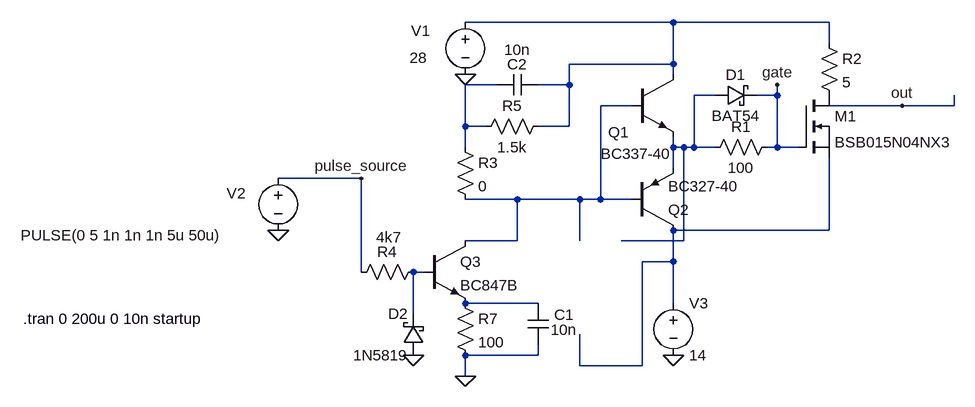
[diagram p0: schematic totem-pole driver.asc]
totem-pole driver.asc, the LTspice schematic file:
Version 4
SHEET 1 1708 680
WIRE -192 32 -512 32
WIRE 48 32 -192 32
WIRE 48 64 48 32
WIRE -192 96 -192 32
WIRE -192 96 -352 96
WIRE -192 112 -192 96
WIRE -464 128 -512 128
WIRE -352 128 -352 96
WIRE -352 128 -400 128
WIRE -128 144 -160 144
WIRE -32 144 -32 128
WIRE -32 144 -64 144
WIRE -256 160 -304 160
WIRE 160 160 48 160
WIRE 240 160 240 144
WIRE 240 160 160 160
WIRE -512 192 -512 128
WIRE -480 192 -512 192
WIRE -352 192 -352 128
WIRE -352 192 -400 192
WIRE -512 224 -512 192
WIRE -192 224 -192 208
WIRE -176 224 -192 224
WIRE -160 224 -160 144
WIRE -160 224 -176 224
WIRE -128 224 -160 224
WIRE -32 224 -32 144
WIRE -32 224 -48 224
WIRE 0 224 -32 224
WIRE -192 256 -192 224
WIRE -672 272 -800 272
WIRE -432 304 -512 304
WIRE -336 304 -432 304
WIRE -304 304 -304 160
WIRE -304 304 -336 304
WIRE -256 304 -304 304
WIRE 48 352 48 240
WIRE 48 352 -192 352
WIRE -432 368 -432 304
WIRE -432 368 -512 368
WIRE -336 368 -336 304
WIRE -176 368 -176 224
WIRE -176 368 -272 368
WIRE -192 400 -192 352
WIRE -192 400 -240 400
WIRE -672 416 -672 272
WIRE -576 416 -592 416
WIRE -400 464 -512 464
WIRE -192 464 -192 400
WIRE -592 480 -592 416
WIRE -400 544 -400 528
WIRE -400 544 -512 544
WIRE -336 560 -336 512
WIRE -240 560 -240 400
WIRE -240 560 -336 560
WIRE -512 576 -512 544
FLAG -512 112 0
FLAG -800 352 0
FLAG -512 576 0
FLAG -672 272 pulse_source
FLAG 160 160 out
FLAG -32 128 gate
FLAG -192 544 0
FLAG -592 544 0
SYMBOL npn -256 112 R0
WINDOW 0 -36 89 Left 2
WINDOW 3 -48 122 Left 2
SYMATTR InstName Q1
SYMATTR Value BC337-40
SYMBOL pnp -256 352 M180
SYMATTR InstName Q2
SYMATTR Value BC327-40
SYMBOL voltage -512 16 R0
WINDOW 0 -83 29 Left 2
WINDOW 3 -86 70 Left 2
WINDOW 123 0 0 Left 0
WINDOW 39 0 0 Left 0
SYMATTR InstName V1
SYMATTR Value 28
SYMBOL voltage -800 256 R0
WINDOW 0 -79 39 Left 2
WINDOW 3 -396 103 Left 2
WINDOW 123 0 0 Left 0
WINDOW 39 0 0 Left 0
SYMATTR InstName V2
SYMATTR Value PULSE(0 5 1n 1n 1n 5u 50u)
SYMBOL npn -576 368 R0
SYMATTR InstName Q3
SYMATTR Value BC847B
SYMBOL res -528 208 R0
SYMATTR InstName R3
SYMATTR Value 0
SYMBOL res -576 400 R90
WINDOW 0 0 56 VBottom 2
WINDOW 3 -53 54 VTop 2
SYMATTR InstName R4
SYMATTR Value 4k7
SYMBOL res -32 208 R90
WINDOW 0 0 56 VBottom 2
WINDOW 3 32 56 VTop 2
SYMATTR InstName R1
SYMATTR Value 100
SYMBOL res 32 48 R0
SYMATTR InstName R2
SYMATTR Value 5
SYMBOL nmos 0 144 R0
SYMATTR InstName M1
SYMATTR Value BSB015N04NX3
SYMBOL res -384 176 R90
WINDOW 0 0 56 VBottom 2
WINDOW 3 32 56 VTop 2
SYMATTR InstName R5
SYMATTR Value 1.5k
SYMBOL voltage -192 448 R0
WINDOW 123 0 0 Left 0
WINDOW 39 0 0 Left 0
SYMATTR InstName V3
SYMATTR Value 14
SYMBOL schottky -128 160 R270
WINDOW 0 32 32 VTop 2
WINDOW 3 0 32 VBottom 2
SYMATTR InstName D1
SYMATTR Value BAT54
SYMATTR Description Diode
SYMATTR Type diode
SYMBOL schottky -576 544 R180
WINDOW 0 24 64 Left 2
WINDOW 3 24 0 Left 2
SYMATTR InstName D2
SYMATTR Value 1N5819
SYMATTR Description Diode
SYMATTR Type diode
SYMBOL res -528 448 R0
SYMATTR InstName R7
SYMATTR Value 100
SYMBOL cap -416 464 R0
WINDOW 0 41 18 Left 2
WINDOW 3 35 41 Left 2
SYMATTR InstName C1
SYMATTR Value 10n
SYMBOL cap -400 112 R90
WINDOW 0 0 32 VBottom 2
WINDOW 3 -54 32 VTop 2
SYMATTR InstName C2
SYMATTR Value 10n
TEXT -1192 488 Left 2 !.tran 0 200u 0 10n startup

The netlist it stands for:
* totem-pole driver.asc
Q1 N001 N004 N003 0 BC337-40
Q2 N005 N004 N003 0 BC327-40
V1 N001 0 28
V2 pulse_source 0 PULSE(0 5 1n 1n 1n 5u 50u)
Q3 N004 N006 N007 0 BC847B
R3 N002 N004 0
R4 N006 pulse_source 4k7
R1 gate N003 100
R2 N001 P001 5
M1 P001 gate N005 N005 BSB015N04NX3
R5 N001 N002 1.5k
V3 N005 0 14
D1 N003 gate BAT54
D2 0 N006 1N5819
R7 N007 0 100
C1 N007 0 10n
C2 N001 N002 10n
.model D D
.lib standard.dio
.model NPN NPN
.model PNP PNP
.lib standard.bjt
.model NMOS NMOS
.model PMOS PMOS
.lib standard.mos
.tran 0 200u 0 10n startup
.backanno
.end